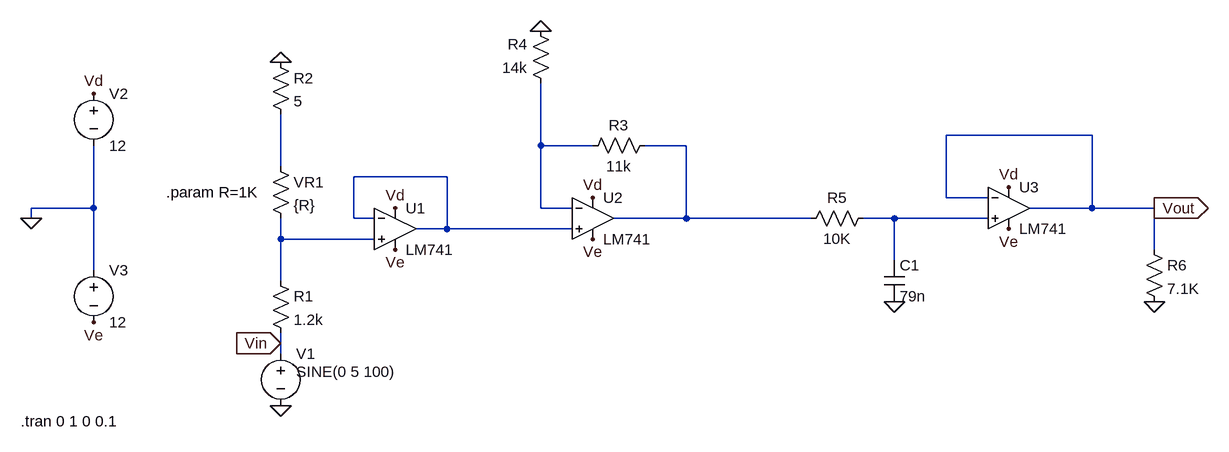
[diagram p0: schematic kagoma1.asc]
kagoma1.asc, the LTspice schematic file:
Version 4
SHEET 1 1200 680
WIRE 992 16 768 16
WIRE 144 32 144 -64
WIRE 224 32 144 32
WIRE 368 32 304 32
WIRE -256 64 -256 -16
WIRE 0 80 -144 80
WIRE 768 112 768 16
WIRE 832 112 768 112
WIRE -544 128 -544 32
WIRE -544 128 -640 128
WIRE 144 128 144 32
WIRE 192 128 144 128
WIRE 992 128 992 16
WIRE 992 128 896 128
WIRE 1088 128 992 128
WIRE -640 144 -640 128
WIRE -144 144 -144 80
WIRE -112 144 -144 144
WIRE 368 144 368 32
WIRE 368 144 256 144
WIRE 560 144 368 144
WIRE 688 144 640 144
WIRE 832 144 688 144
WIRE 0 160 0 80
WIRE 0 160 -48 160
WIRE 192 160 0 160
WIRE -256 176 -256 144
WIRE -112 176 -256 176
WIRE 1088 192 1088 128
WIRE 688 208 688 144
WIRE -544 224 -544 128
WIRE -256 240 -256 176
WIRE -256 336 -256 320
WIRE -256 352 -256 336
FLAG -256 -96 0
FLAG -256 432 0
FLAG 144 -144 0
FLAG 1088 272 0
FLAG 688 272 0
FLAG -256 336 Vin
IOPIN -256 336 In
FLAG 1088 128 Vout
IOPIN 1088 128 Out
FLAG 864 96 Vd
FLAG 864 160 Ve
FLAG 224 112 Vd
FLAG 224 176 Ve
FLAG -80 128 Vd
FLAG -80 192 Ve
FLAG -544 -48 Vd
FLAG -544 304 Ve
FLAG -640 144 0
SYMBOL OpAmps\\LM741 -80 96 R0
SYMATTR InstName U1
SYMBOL res -272 224 R0
SYMATTR InstName R1
SYMATTR Value 1.2k
SYMBOL res -272 48 R0
SYMATTR InstName VR1
SYMATTR Value {R}
SYMBOL res -272 -112 R0
SYMATTR InstName R2
SYMATTR Value 5
SYMBOL voltage -256 336 R0
WINDOW 123 0 0 Left 0
WINDOW 39 0 0 Left 0
WINDOW 3 24 44 Left 2
SYMATTR InstName V1
SYMATTR Value SINE(0 5 100)
SYMBOL OpAmps\\LM741 224 80 R0
SYMATTR InstName U2
SYMBOL res 320 16 R90
WINDOW 0 0 56 VBottom 2
WINDOW 3 32 56 VTop 2
SYMATTR InstName R3
SYMATTR Value 11k
SYMBOL res 160 -48 R180
WINDOW 0 36 76 Left 2
WINDOW 3 36 40 Left 2
SYMATTR InstName R4
SYMATTR Value 14k
SYMBOL res 656 128 R90
WINDOW 0 0 56 VBottom 2
WINDOW 3 32 56 VTop 2
SYMATTR InstName R5
SYMATTR Value 10K
SYMBOL cap 672 208 R0
SYMATTR InstName C1
SYMATTR Value 79n
SYMBOL OpAmps\\LM741 864 64 R0
SYMATTR InstName U3
SYMBOL res 1072 176 R0
SYMATTR InstName R6
SYMATTR Value 7.1K
SYMBOL voltage -544 -64 R0
WINDOW 123 0 0 Left 0
WINDOW 39 0 0 Left 0
SYMATTR InstName V2
SYMATTR Value 12
SYMBOL voltage -544 208 R0
WINDOW 123 0 0 Left 0
WINDOW 39 0 0 Left 0
SYMATTR InstName V3
SYMATTR Value 12
TEXT -432 104 Left 2 !.param R=1K
TEXT -656 456 Left 2 !.tran 0 1 0 0.1

The netlist it stands for:
* kagoma1.asc
XU1 N006 N004 Vd Ve N004 LM741  ; pins In+ In- V+ V- OUT
R1 N006 Vin 1.2k
R§VR1 N003 N006 {R}
R2 0 N003 5
V1 Vin 0 SINE(0 5 100)
XU2 N004 N001 Vd Ve N002 LM741  ; pins In+ In- V+ V- OUT
R3 N002 N001 11k
R4 N001 0 14k
R5 N005 N002 10K
C1 N005 0 79n
XU3 N005 Vout Vd Ve Vout LM741  ; pins In+ In- V+ V- OUT
R6 Vout 0 7.1K
V2 Vd 0 12
V3 0 Ve 12
.param R=1K
.tran 0 1 0 0.1
.lib LM741.lib
.backanno
.end